# EAGLE schematic ECU_MULT_CAR (EAGLE 7.4.0), part 2 of 2
## Sheet 20 of 20
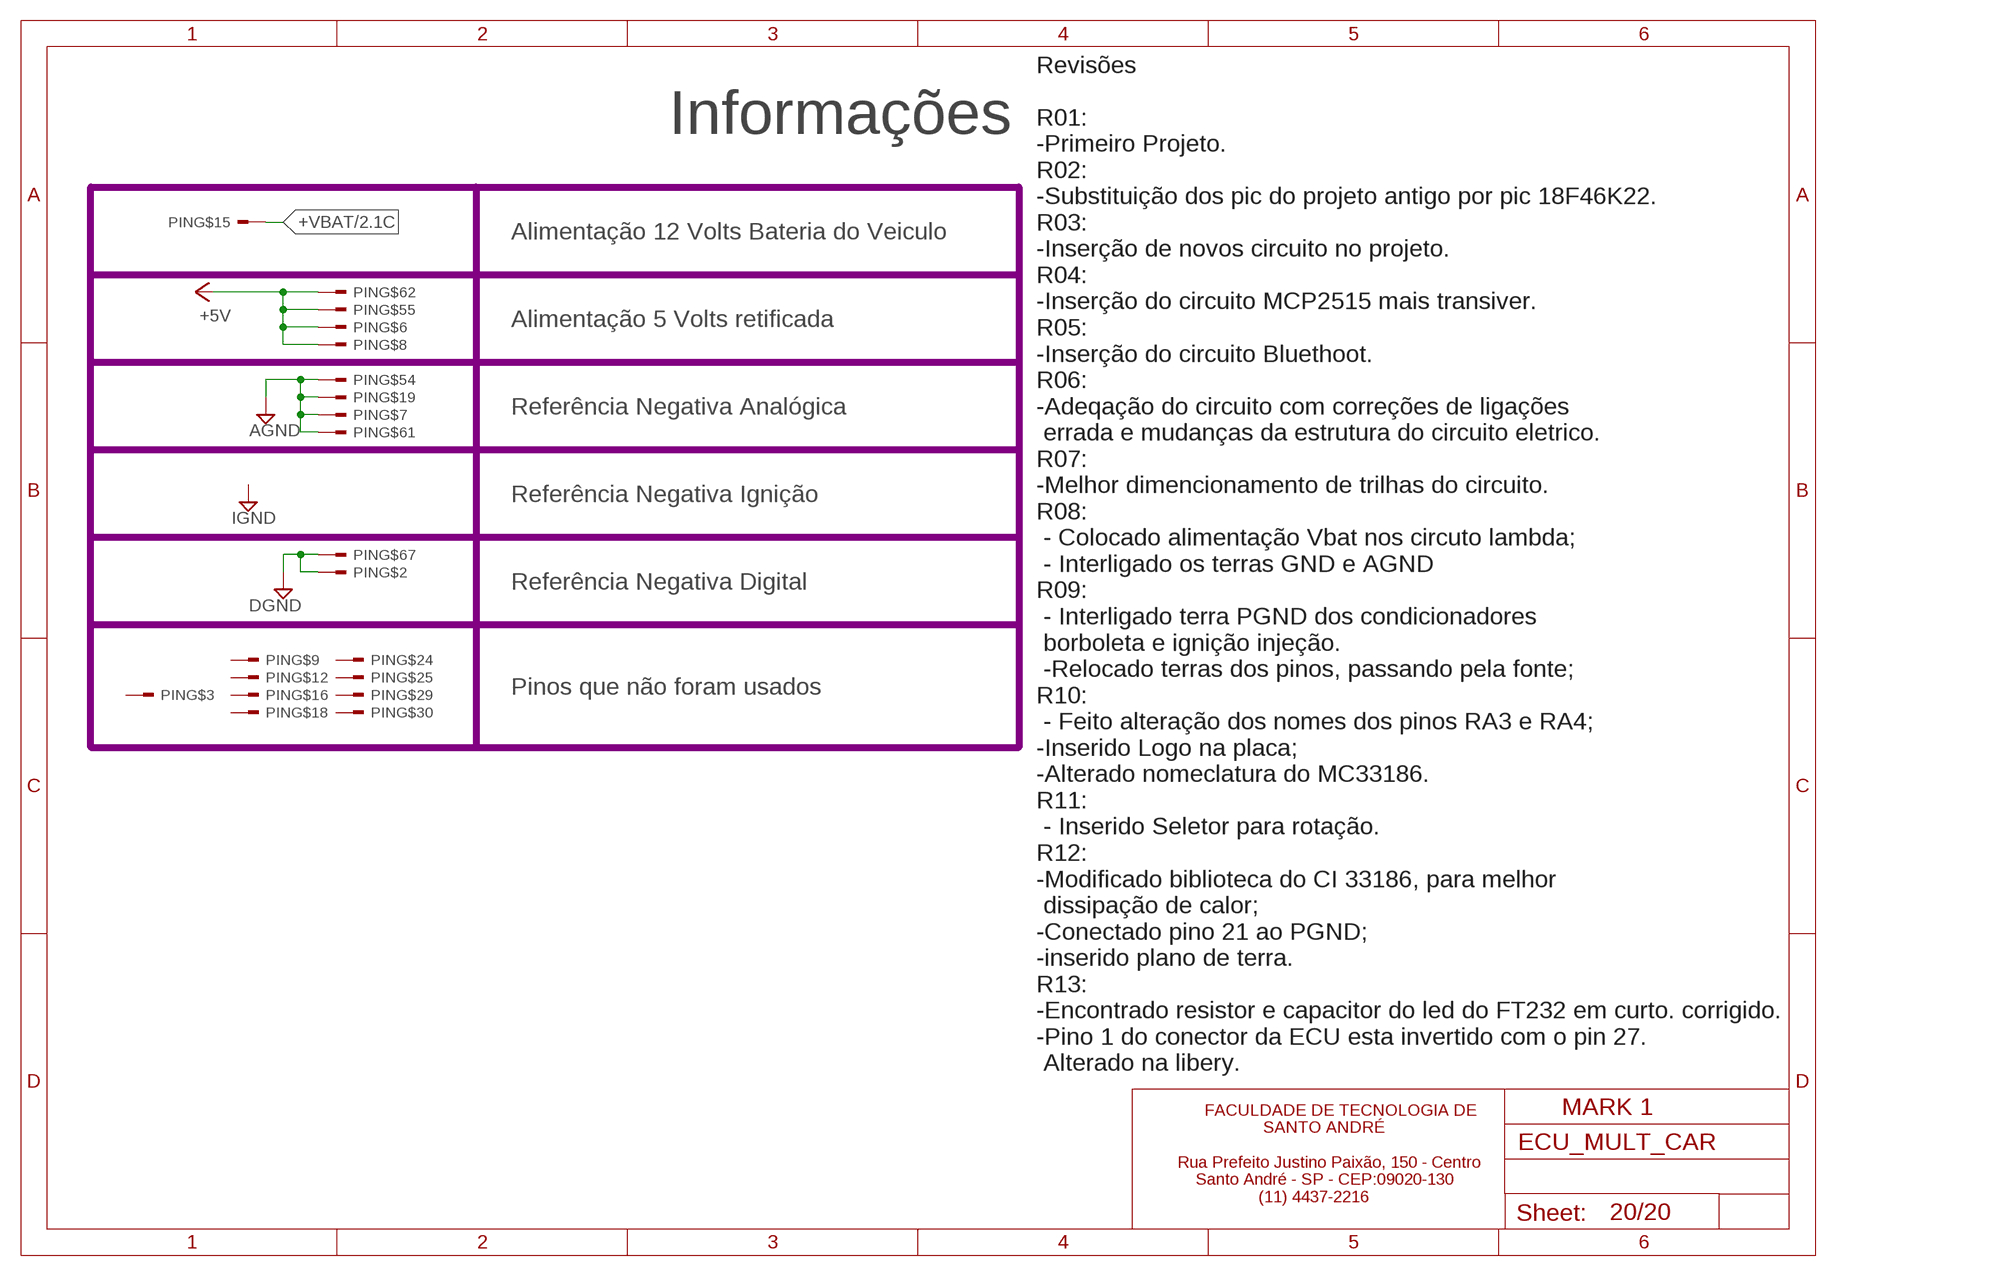
[diagram p19: schematic, sheet 20]

### Nets
+5V: PIN.6 PIN.8 PIN.55 PIN.62 ; also sheet 1,2,3,4,5,6,7,8,9,10,11,12,13,14,15,16,17,18
+VBAT: PIN.15 ; also sheet 2
DGND: PIN.2 PIN.67 ; also sheet 1,2,3,7,8,9,10,11,14,15,17,18,19
GND3: PIN.7 PIN.19 PIN.54 PIN.61 ; supply symbol labelled AGND ; also sheet 2,4,5,6,12,13,16
Unconnected: PIN.3 PIN.9 PIN.12 PIN.16 PIN.18 PIN.24 PIN.25 PIN.29 PIN.30

### Notes on the sheet
- Informações
- Alimentação 12 Volts Bateria do Veiculo
- Alimentação 5 Volts retificada
- Referência Negativa Analógica
- Referência Negativa Ignição
- Referência Negativa Digital
- Pinos que não foram usados
- Revisões
  
  R01:
  -Primeiro Projeto.
  R02:
  -Substituição dos pic do projeto antigo por pic 18F46K22.
  R03:
  -Inserção de novos circuito no projeto.
  R04:
  -Inserção do circuito MCP2515 mais transiver.
  R05:
  -Inserção do circuito Bluethoot.
  R06:
  -Adeqação do circuito com correções de ligações
   errada e mudanças da estrutura do circuito eletrico.
  R07:
  -Melhor dimencionamento de trilhas do circuito.
  R08:
   - Colocado alimentação Vbat nos circuto lambda;
   - Interligado os terras GND e AGND
  R09:
   - Interligado terra PGND dos condicionadores
   borboleta e ignição injeção.
   -Relocado terras dos pinos, passando pela fonte;
  R10:
   - Feito alteração dos nomes dos pinos RA3 e RA4;
  -Inserido Logo na placa;
  -Alterado nomeclatura do MC33186.
  R11:
   - Inserido Seletor para rotação.
  R12:
  -Modificado biblioteca do CI 33186, para melhor
   dissipação de calor;
  -Conectado pino 21 ao PGND;
  -inserido plano de terra.
  R13:
  -Encontrado resistor e capacitor do led do FT232 em curto. corrigido.
  -Pino 1 do conector da ECU esta invertido com o pin 27.
   Alterado na libery.
- MARK 1
- FACULDADE DE TECNOLOGIA DE 
                             SANTO ANDRÉ
  
          Rua Prefeito Justino Paixão, 150 - Centro  
              Santo André - SP - CEP:09020-130
                            (11) 4437-2216

## Library data of the parts
+5V +12V BOB1 BOB2 IGN1-IGN4 INJ1-INJ4 LED1-LED4 LED16 RX RXCAN TX TXCAN = led:LED: LED OSRAM: - CHIPLED LG R971, LG N971, LY N971, LG Q971, LY Q971, LO R971, LY R971 LH N974, LH R974 LS Q976, LO Q976, LY Q976 LO Q996 - Hyper CHIPLED LW Q18S LB Q993, LB Q99A, LB R99A - SideLED LS A670, LO A670, LY A670, LG A670, LP A670 LB A673, LV A673, LT A673, LW A673 LH A674 LY A675 LS A676, LA A676, LO A676, LY A676, LW A676 LS A679, LY A679, LG A679 - Hyper Micro SIDELED® LS Y876, LA Y876, LO Y876, LY Y876 LT Y87S - SmartLED LW L88C, LW L88S LB L89C, LB L89S, LG L890 LS L89K, LO L89K, LY L89K LS L896, LA L896, LO L896, LY L896 - TOPLED LS T670, LO T670, LY T670, LG T670, LP T670 LSG T670, LSP T670, LSY T670, LOP T670, LYG T670 LG T671, LOG T671, LSG T671 LB T673, LV T673, LT T673, LW T673 LH T674 LS T676, LA T676, LO T676, LY T676, LB T676, LH T676, LSB T676, LW T676 LB T67C, LV T67C, LT T67C, LS T67K, LO T67K, LY T67K, LW E67C LS E67B, LA E67B, LO E67B, LY E67B, LB E67C, LV E67C, LT E67C LW T67C LS T679, LY T679, LG T679 LS T770, LO T770, LY T770, LG T770, LP T770 LB T773, LV T773, LT T773, LW T773 LH T774 LS E675, LA E675, LY E675, LS T675 LS T776, LA T776, LO T776, LY T776, LB T776 LHGB T686 LT T68C, LB T68C - Hyper Mini TOPLED® LB M676 - Mini TOPLED Santana® LG M470 LS M47K, LO M47K, LY M47K Source: http://www.osram.convergy.de LUXEON: - LUMILED® LXK2-PW12-R00, LXK2-PW12-S00, LXK2-PW14-U00, LXK2-PW14-V00 LXK2-PM12-R00, LXK2-PM12-S00, LXK2-PM14-U00 LXK2-PE12-Q00, LXK2-PE12-R00, LXK2-PE12-S00, LXK2-PE14-T00, LXK2-PE14-U00 LXK2-PB12-K00, LXK2-PB12-L00, LXK2-PB12-M00, LXK2-PB14-N00, LXK2-PB14-P00, LXK2-PB14-Q00 LXK2-PR12-L00, LXK2-PR12-M00, LXK2-PR14-Q00, LXK2-PR14-R00 LXK2-PD12-Q00, LXK2-PD12-R00, LXK2-PD12-S00 LXK2-PH12-R00, LXK2-PH12-S00 LXK2-PL12-P00, LXK2-PL12-Q00, LXK2-PL12-R00 Source: www.luxeon.com KINGBRIGHT: KA-3528ASYC Source: www.kingbright.com
ADMISSÃO COMUNICACAO GERENCIAMENTO SINCRONISMO = MyLibs:PIC18F44K22
ANTER_IN BORBOLETA_1 BORBOLETA_2 COND_ANA2_IN COND_ANA_1_IN LINHA15 LINHA_15_IN MAP_IN MAP_OUT MEDI_VELO_IN MEDI_VELO_OUT PEDAL1_IN PEDAL2_IN RA0_ADMISS_TPS_1 RA0_GERENC_BATERIA RA1_ADMISS_TPS_2 RA1_GERENC_PEDAL_1 RA2_ADMISS_ALTERNADOR RA2_GERENC_PEDAL2 RB5_GERENC_PRESSãO_A/C RC2_GERENCI_COMBUSTIVEL RC7_GERENCIA_EMBREAGEM RD2_GERENC_FREIO_1 RD5_GERENC_FREIO_2 RD6_GERENC_BOTÃO_A/C RE2_SINCRO_FASE RELUTÂNCIA ROT_ANAL ROT_DIG_IN ROT_DIG_OUT SENSO_EMBR_IN SENSO_FREIO_IN SENSOR_COMB_IN SENSOR_FASE_IN SENSOR_IN SENSOR_IN1 TEMP_AR_IN TEMP_AR_OUT TEMP_H2O_IN TEMP_H2O_OUT TPS_1_IN TPS_2_IN = MyLibs:PINO_TORNEADO: Pino para ponto de medição na placa
C1-C38 C40-C62 C65 C67-C91 C93 C94 C96 C97 C99-C112 C114-C118 C120 C121 C123-C128 C130-C134 = resistor:C-EU: CAPACITOR, European symbol
C39 C63 C64 C66 C95 C98 C113 C119 C122 = rcl:CPOL-EU: POLARIZED CAPACITOR, European symbol
D1-D3 D5 D6 D8-D22 = diode:DIODE-: DIODE
D4 = diode:1N4004: DIODE general purpose rectifier, 1 A
D7 D23 = diode:1N5624: DIODE controlled avalanche rectifier
IC1-IC7 IC9-IC11 = linear:LM358: OP AMP also LM158; LM258; LM2904 Source: http://cache.national.com/ds/LM/LM158.pdf
IC8 = national-semiconductor:LM2596: SIMPLE SWITCHER® Power Converter 150 kHz 3A Step-Down Voltage Regulator Source: http://www.national.com/ds/LM/LM2596.pdf; MF: NATIONAL SEMICONDUCTOR; MPN: LM2596S-ADJ/NOPB; OC_FARNELL: 9494367; OC_NEWARK: 41K3842
IC12 = ftdichip:FT232R: Source: http://www.ftdichip.com/Documents/DataSheets/DS_FT232R_v104.pdf; MPN: FT232RL; OC_FARNELL: 1146032; OC_NEWARK: 91K9918
JP1-JP3 JP5 = jumper:JP3Q: JUMPER
L1 = rcl:L-US: INDUCTOR, American symbol
MC1 = MyLibs:MC33810: CI Controlador de motor automotivo
OP.MODE SENSIBILIDADE = switch:M251: SLIDING SWITCH Mors, distributor Buerklin, 11G702
PIN = MyLibs:CONCTOR_BOSCH
Q1-Q4 Q6 Q7 = crystal:CRYSTAL: CRYSTAL; OC_FARNELL: unknown; OC_NEWARK: unknown
R1-R12 R14-R19 R21-R41 R43-R48 R52-R160 R162-R174 R177 = rcl:R-EU_: RESISTOR, European symbol
R13 R20 = pot:TRIM_EU-: POTENTIOMETER
R42 R49-R51 = resistor:R-EU_: RESISTOR, European symbol
S1 S2 = switch:2P2T: SLIDE SWITCH 2P2T Part No. SS-22F05-G(A)4 Source: CANAL ELECTRONIC CO., LTD .. switsch.pdf
S3-S6 = switch-omron:10-XX: OMRON SWITCH; MPN: B3F-1000; OC_FARNELL: 176432; OC_NEWARK: 36M3542
SV1 SV2 = con-lstb:MA03-1: PIN HEADER; OC_FARNELL: unknown; OC_NEWARK: unknown
SV3 = con-lstb:MA04-2: PIN HEADER; OC_FARNELL: unknown; OC_NEWARK: unknown
U1-U3 = MyLibs:LM339
U20 = NXP_By_element14_Batch_1:PCA82C251T/N3: CAN transceiver; MPN: PCA82C251T/N3; OC_FARNELL: 1201274; OC_NEWARK: -; PACKAGE: SOIC-8; SUPPLIER: NXP
U$1 U$13 U$16 U$17 U$26-U$30 = MyLibs:IRLL014N
U$2 = MyLibs:LM1815
U$3 = MyLibs:MC33186
U$4 U$6-U$8 = MyLibs:IRGS14C40L
U$9 U$10 = MyLibs:AD623
U$11 = MyLibs:MAGIRUS_17105
U$19 = MyLibs:JHD162A
U$22 = MyLibs:TPIC8101: O TPIC8101 é uma interface para sensor de resonancia knock.
U$31 = Microchip_By_element14_Batch_1:MCP2515-I/SO: CAN Controller; MPN: MCP2515-I/SO; OC_FARNELL: 1292239; OC_NEWARK: 29H7136; PACKAGE: SOIC-18; SUPPLIER: Microchip
U$32 = MyLibs:TRIMPOT
U$33 = MyLibs:HC-06
X2 = con-cypressindustries:MINI-USB-: MINI USB-B Conector Source: www.cypressindustries.com; OC_FARNELL: unknown; OC_NEWARK: unknown
X3 = con-phoenix-508:MKDSN1,5/2-5,08: MKDSN 1,5/ 2-5,08 Printklemme Nennstrom: 13,5 A Nennspannung: 250 V Rastermaß: 5,08 mm Polzahl: 2 Anschlussart: Schraubanschluss Montage: Löten Anschlussrichtung Leiter/Platine: 0 ° Artikelnummer: 1729128 Source: http://eshop.phoenixcontact.com .. 1729128.pdf
X4 X6 = con-phoenix-508:MKDSN1,5/3-5,08: MKDSN 1,5/ 3-5,08 Printklemme Nennstrom: 13,5 A Nennspannung: 250 V Rastermaß: 5,08 mm Polzahl: 3 Anschlussart: Schraubanschluss Montage: Löten Anschlussrichtung Leiter/Platine: 0 ° Artikelnummer: 1729131 Source: http://eshop.phoenixcontact.com .. 1729131.pdf
X5 = con-phoenix-508:MKDSN1,5/4-5,08: MKDSN 1,5/ 4-5,08 Printklemme Nennstrom: 13,5 A Nennspannung: 250 V Rastermaß: 5,08 mm Polzahl: 4 Anschlussart: Schraubanschluss Montage: Löten Anschlussrichtung Leiter/Platine: 0 ° Artikelnummer: 1729144 Source: http://eshop.phoenixcontact.com .. 1729144.pdf

## Net classes
0 default: clearance 0.205 mm